# EAGLE design Atari 7800 (EAGLE 9.6.2)
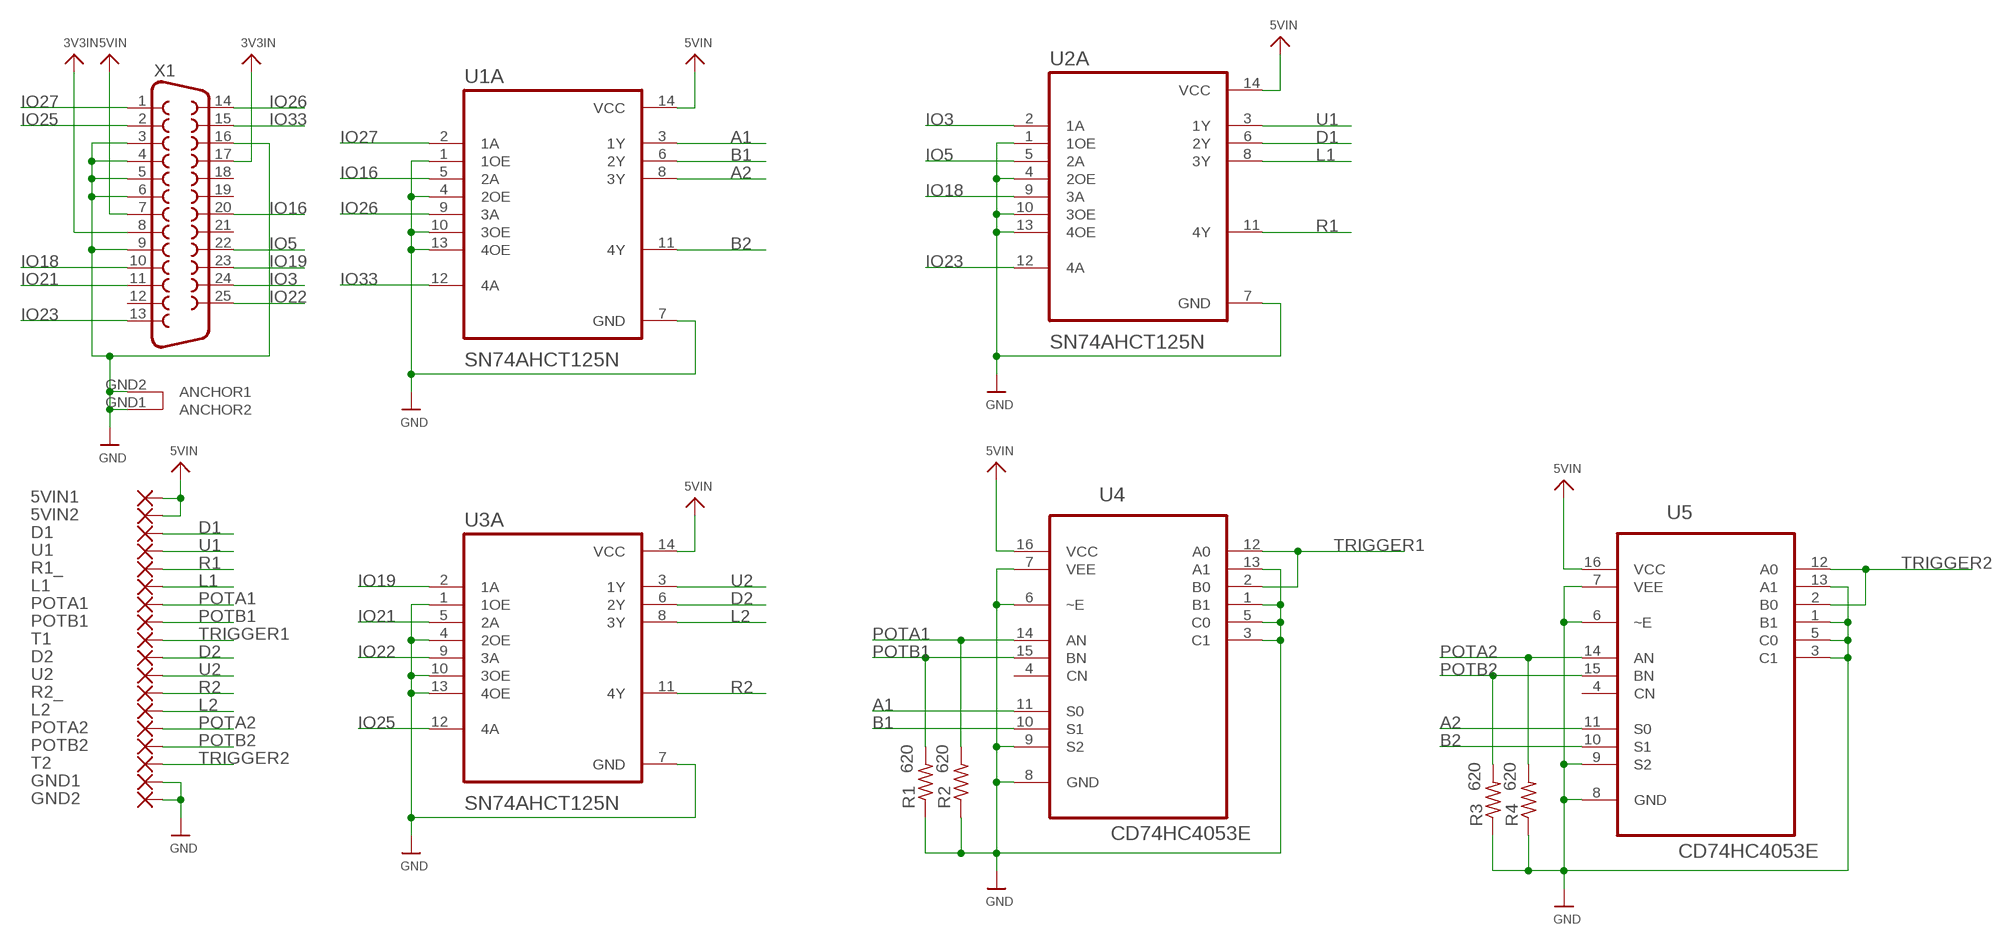
[diagram p0: schematic, sheet 1]

## Parts
5VIN1  SMD5  [SMD2,54-5,08]
5VIN2  SMD5  [SMD2,54-5,08]
D1  SMD5  [SMD2,54-5,08]
D2  SMD5  [SMD2,54-5,08]
GND1  SMD5  [SMD2,54-5,08]
GND2  SMD5  [SMD2,54-5,08]
L1  SMD5  [SMD2,54-5,08]
L2  SMD5  [SMD2,54-5,08]
POTA1  SMD5  [SMD2,54-5,08]
POTA2  SMD5  [SMD2,54-5,08]
POTB1  SMD5  [SMD2,54-5,08]
POTB2  SMD5  [SMD2,54-5,08]
R1  620  R-US_R1206  [R1206]
R1_  SMD5  [SMD2,54-5,08]
R2  620  R-US_R1206  [R1206]
R2_  SMD5  [SMD2,54-5,08]
R3  620  R-US_R1206  [R1206]
R4  620  R-US_R1206  [R1206]
T1  SMD5  [SMD2,54-5,08]
T2  SMD5  [SMD2,54-5,08]
U1  SMD5  [SMD2,54-5,08]
U1A  SN74AHCT125N  [DIP794W45P254L1969H508Q14]
U2  SMD5  [SMD2,54-5,08]
U2A  SN74AHCT125N  [DIP794W45P254L1969H508Q14]
U3A  SN74AHCT125N  [DIP794W45P254L1969H508Q14]
U4  CD74HC4053E  [DIP254P762X508-16]
U5  CD74HC4053E  [DIP254P762X508-16]
X1  DB25_FEMALEHP  [F25HP]

## Nets
3V3IN: X1.8 X1.17
5VIN: 5VIN1.1(P) 5VIN2.1(P) U1A.14(VCC) U2A.14(VCC) U3A.14(VCC) U4.16(VCC) U5.16(VCC) X1.7
A1: U1A.3(1Y) U4.11(S0)
A2: U1A.8(3Y) U5.11(S0)
B1: U1A.6(2Y) U4.10(S1)
B2: U1A.11(4Y) U5.10(S1)
D1: D1.1(P) U2A.6(2Y)
D2: D2.1(P) U3A.6(2Y)
GND: GND1.1(P) GND2.1(P) R1.1 R2.1 R3.1 R4.1 U1A.1(1OE) U1A.4(2OE) U1A.7(GND) U1A.10(3OE) U1A.13(4OE) U2A.1(1OE) U2A.4(2OE) U2A.7(GND) U2A.10(3OE) U2A.13(4OE) U3A.1(1OE) U3A.4(2OE) U3A.7(GND) U3A.10(3OE) U3A.13(4OE) U4.1(B1) U4.3(C1) U4.5(C0) U4.6(~E) U4.7(VEE) U4.8(GND) U4.9(S2) U4.13(A1) U5.1(B1) U5.3(C1) U5.5(C0) U5.6(~E) U5.7(VEE) U5.8(GND) U5.9(S2) U5.13(A1) X1.3 X1.4 X1.5 X1.6 X1.9 X1.16 X1.GND1(ANCHOR2) X1.GND2(ANCHOR1)
IO3: U2A.2(1A) X1.24
IO5: U2A.5(2A) X1.22
IO16: U1A.5(2A) X1.20
IO18: U2A.9(3A) X1.10
IO19: U3A.2(1A) X1.23
IO21: U3A.5(2A) X1.11
IO22: U3A.9(3A) X1.25
IO23: U2A.12(4A) X1.13
IO25: U3A.12(4A) X1.2
IO26: U1A.9(3A) X1.14
IO27: U1A.2(1A) X1.1
IO33: U1A.12(4A) X1.15
L1: L1.1(P) U2A.8(3Y)
L2: L2.1(P) U3A.8(3Y)
POTA1: POTA1.1(P) R2.2 U4.14(AN)
POTA2: POTA2.1(P) R4.2 U5.14(AN)
POTB1: POTB1.1(P) R1.2 U4.15(BN)
POTB2: POTB2.1(P) R3.2 U5.15(BN)
R1: R1_.1(P) U2A.11(4Y)
R2: R2_.1(P) U3A.11(4Y)
TRIGGER1: T1.1(P) U4.2(B0) U4.12(A0)
TRIGGER2: T2.1(P) U5.2(B0) U5.12(A0)
U1: U1.1(P) U2A.3(1Y)
U2: U2.1(P) U3A.3(1Y)
Unconnected: U4.4(CN) U5.4(CN) X1.12 X1.18 X1.19 X1.21

## Library data of the parts
5VIN1 5VIN2 D1 D2 GND1 GND2 L1 L2 POTA1 POTA2 POTB1 POTB2 R1_ R2_ T1 T2 U1 U2 = wirepad:SMD5: SMD PAD
R1-R4 = adafruit:R-US_: RESISTOR, American symbol
U1A U2A U3A = SN74AHCT125N:SN74AHCT125N: None Check prices <https://pricing.snapeda.com/parts/SN74AHCT125N/Texas%20Instruments/view-part?ref=eda>; AVAILABILITY: In Stock; DESCRIPTION: Quadruple Bus Buffer Gates With 3-State Outputs 14-PDIP -40 to 125; MF: Texas Instruments; MP: SN74AHCT125N; PACKAGE: PDIP-14 Texas Instruments; PRICE: None; PURCHASE-URL: https://pricing.snapeda.com/search/part/SN74AHCT125N/?ref=eda
U4 U5 = CD74HC4053E:CD74HC4053E: HIGH-SPEED CMOS LOGIC ANALOG MULTIPLEXERS/DEMULTIPLEXERS; DESCRIPTION: 5-V, 2:1 (SPDT) 3-channel analog switch; DIGI-KEY_PART_NUMBER: 296-9219-5-ND; MF: Texas; MP: CD74HC4053E; PACKAGE: PDIP-16 Texas Instruments; PURCHASE-URL: https://pricing.snapeda.com/search/part/CD74HC4053E/?ref=eda
X1 = SparkFun-Retired:DB25_FEMALE: 25 Pin male connector. PCB edge mount for regular PCB thicknesses. This connector will connect directly to the back of a PC parallel port or through a normal DB25 extension cable (M/F). SKU: PRT-08287

## Board
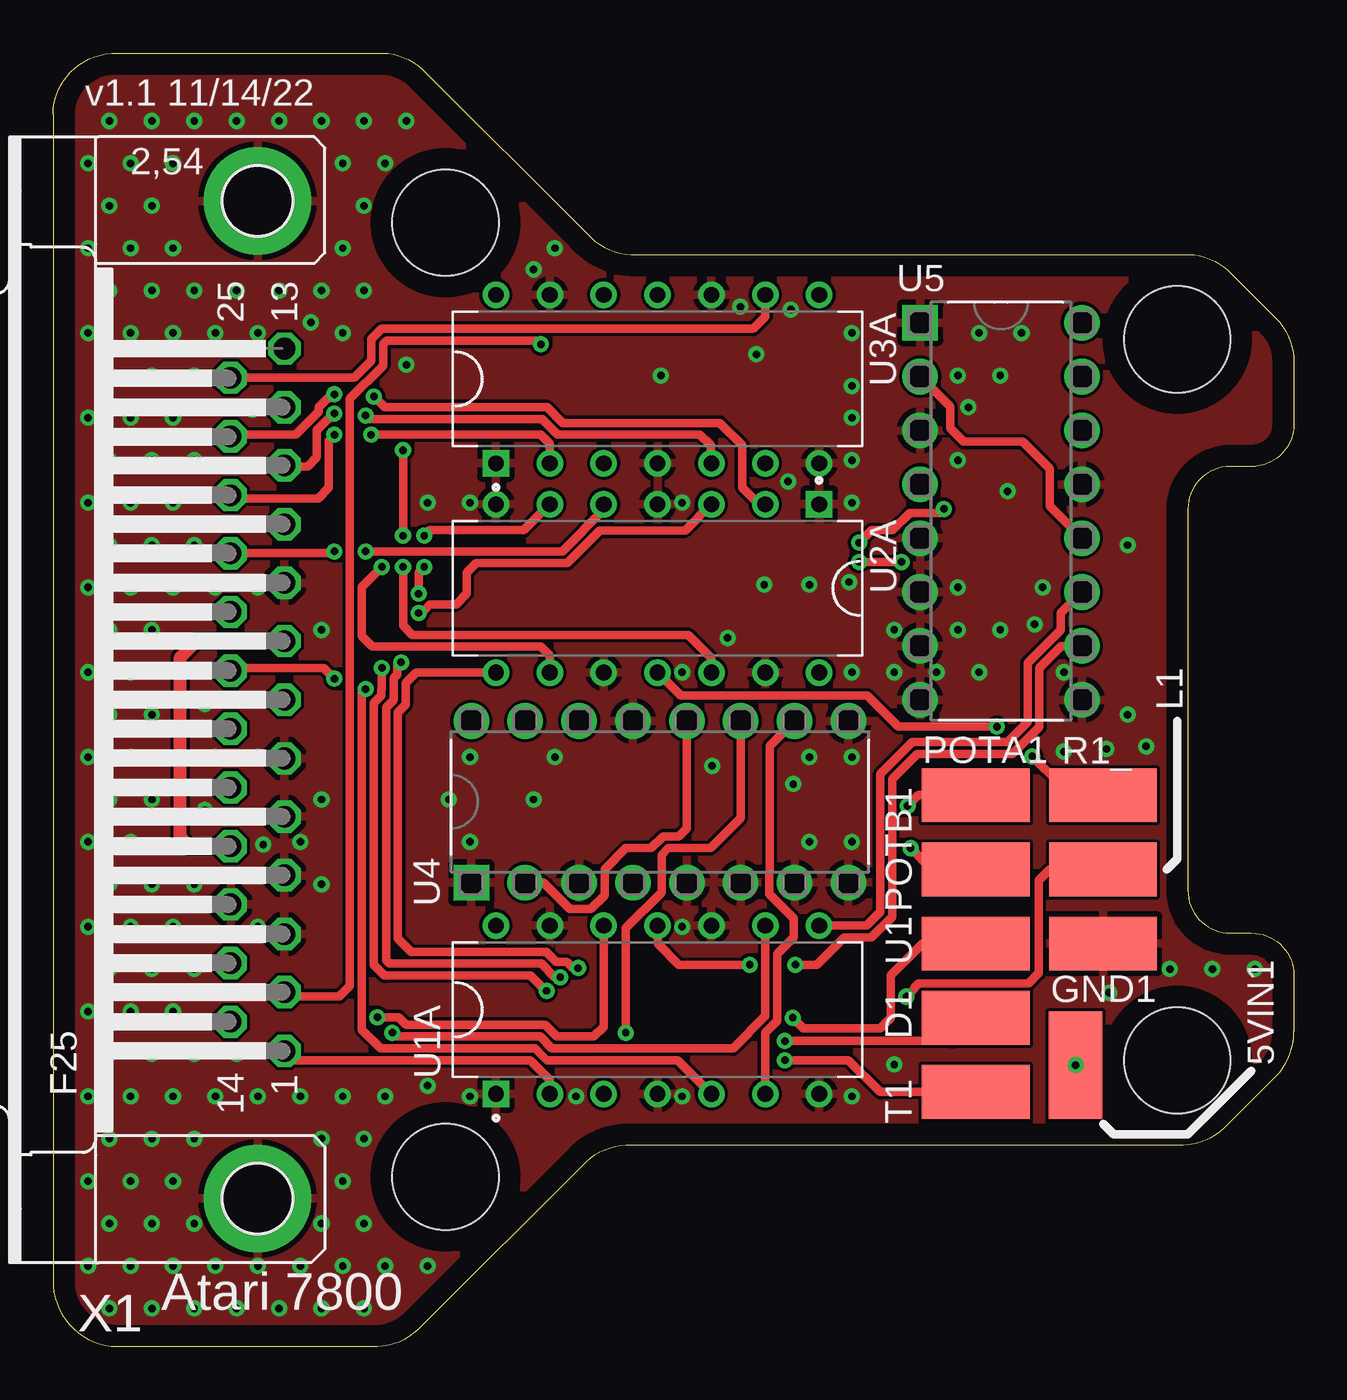
[diagram p1: board, top side]
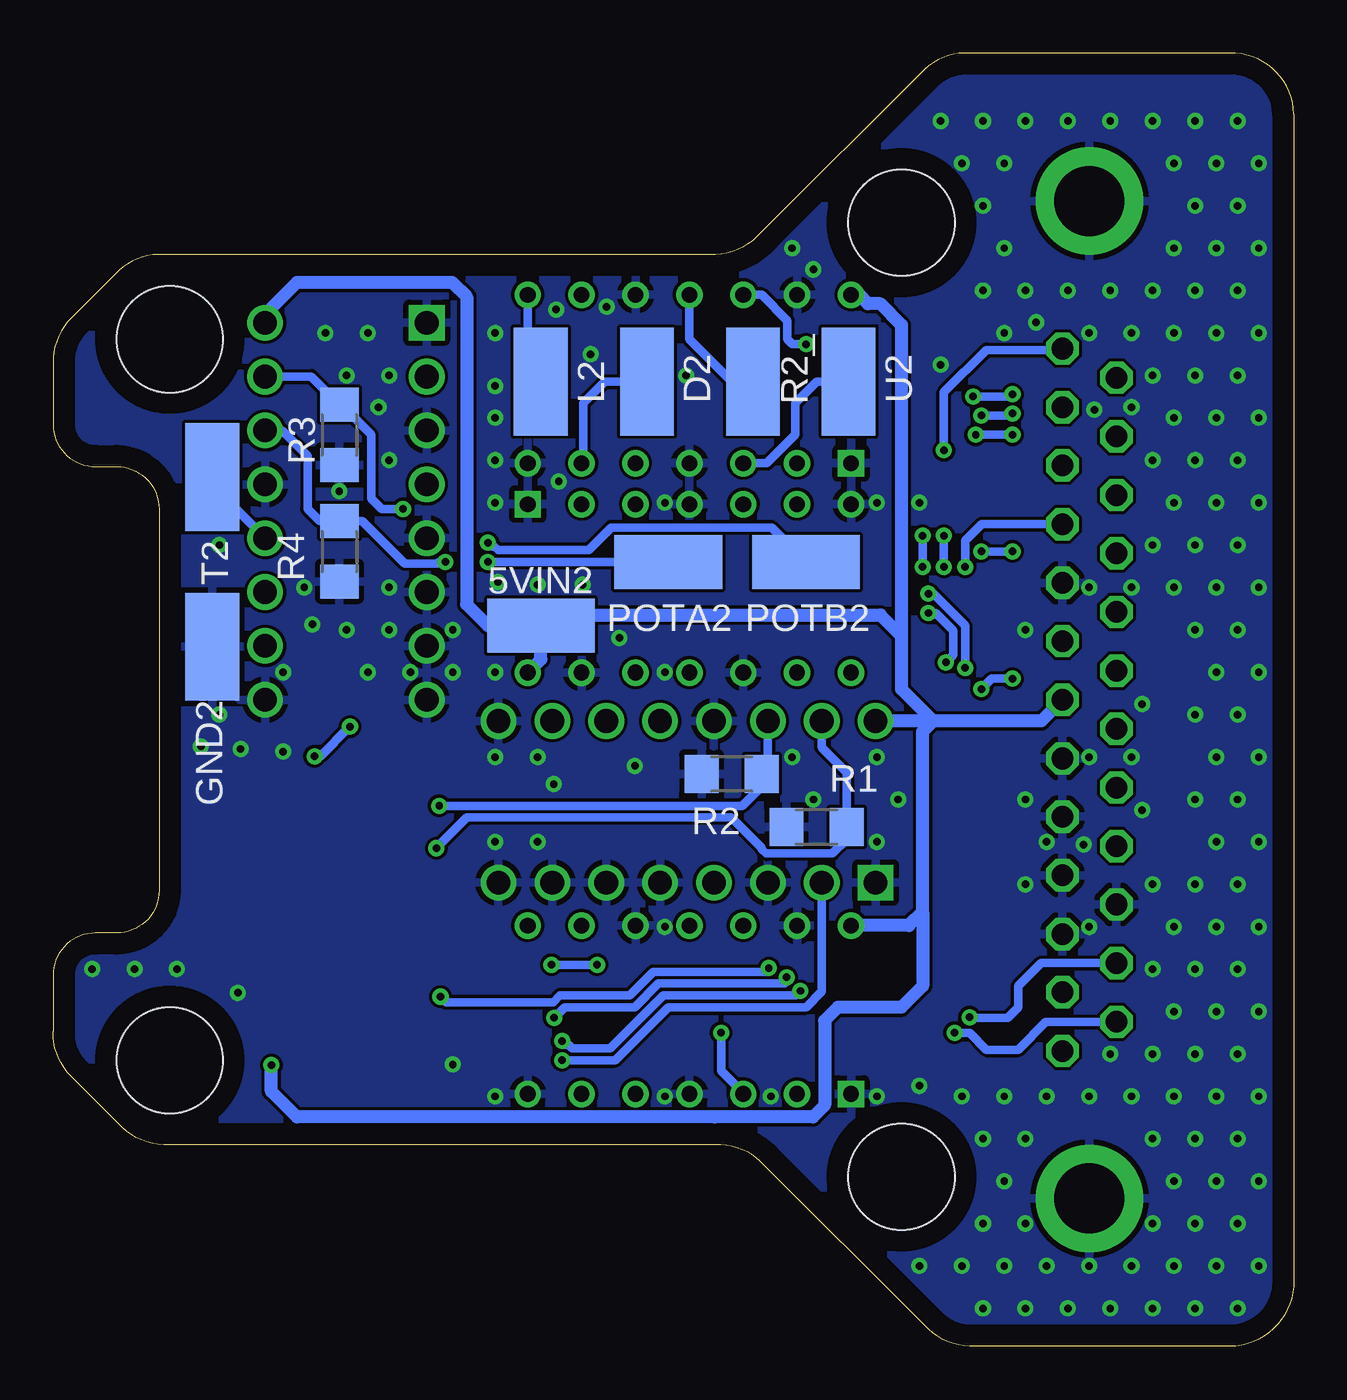
[diagram p2: board, bottom side, seen from below]

Size 58.5 x 61 mm. Coordinates in mm from the lower left corner, seen from the top.
Outline: 0,58.12 0,3.12 arc90 3.03,0 15.29,0 arc45 17.41,1 25.15,8.74 arc-45 27.27,9.5 53.29,9.5 arc45 55.41,10.5 57.65,12.74 arc45 58.5,14.86 58.5,17.5 arc90 56.5,19.5 55.5,19.5 arc-90 53.5,21.5 53.5,39.5 arc-90 55.5,41.5 56.5,41.5 arc90 58.5,43.5 58.5,46.38 arc45 57.65,48.5 55.41,50.74 arc45 53.29,51.5 27.27,51.5 arc-45 25.15,52.5 17.41,60.24 arc45 15.29,61 3.03,61 arc90 0,58.12
Copper layers (1*16): Top 0.035mm / dielectric 1.5mm / Bottom 0.035mm
Design rules "default": minimum track width 6mil, minimum drill 0.35mm, track to track 6mil, track to pad 6mil, pad to pad 6mil, via to via 6mil, smd to smd 6mil, copper to edge 40mil, drill to drill 6mil, minimum pad ring 10mil, minimum via ring 8mil, stop-mask expansion 4mil, vias tented up to drill 0.5mm, thermal gap 10mil
Holes 5 mm at 53,13.5 53,47.5 18.5,53 18.5,8

### Footprints (pad centres in the part's own frame; a part is rotated, then mirrored left to right if it is on the bottom)
SMD2,54-5,08 = smd 2.54 x 5.08: 1 0,0
R1206 = smd 1.6 x 1.803: 1 -1.422,0; 2 1.422,0
DIP794W45P254L1969H508Q14 = drill 0.74 pad 1.14 square: 1 -3.97,7.62 | drill 0.74 pad 1.14: 2 -3.97,5.08; 3 -3.97,2.54; 4 -3.97,0; 5 -3.97,-2.54; 6 -3.97,-5.08; 7 -3.97,-7.62; 8 3.97,-7.62; 9 3.97,-5.08; 10 3.97,-2.54; 11 3.97,0; 12 3.97,2.54; 13 3.97,5.08; 14 3.97,7.62
DIP254P762X508-16 = drill 1.118 square: 1 -7.62,17.78 | drill 1.118: 2 -7.62,15.24; 3 -7.62,12.7; 4 -7.62,10.16; 5 -7.62,7.62; 6 -7.62,5.08; 7 -7.62,2.54; 8 -7.62,0; 9 0,0; 10 0,2.54; 11 0,5.08; 12 0,7.62; 13 0,10.16; 14 0,12.7; 15 0,15.24; 16 0,17.78
F25HP = drill 1.016 octagon: 1 -16.561,-1.27; 2 -13.792,-1.27; 3 -11.049,-1.27; 4 -8.28,-1.27; 5 -5.512,-1.27; 6 -2.769,-1.27; 7 0,-1.27; 8 2.769,-1.27; 9 5.512,-1.27; 10 8.28,-1.27; 11 11.049,-1.27; 12 13.792,-1.27; 13 16.561,-1.27; 14 -15.189,1.27; 15 -12.421,1.27; 16 -9.652,1.27; 17 -6.909,1.27; 18 -4.14,1.27; 19 -1.372,1.27; 20 1.372,1.27; 21 4.14,1.27; 22 6.909,1.27; 23 9.652,1.27; 24 12.421,1.27; 25 15.189,1.27 | drill 3.302 pad 5.08: GND1 -23.52,0; GND2 23.52,0

### Placement (x,y rotation side)
5VIN1  48.21,13.28 0 top
5VIN2  35.5,34 270 bottom
D1  43.5,15.5 270 top
D2  30.5,45.5 180 bottom
GND1  49.5,19 90 top
GND2  51,33 180 bottom
L1  49.5,22.5 270 top
L2  35.5,45.5 180 bottom
POTA1  43.5,26 270 top
POTA2  29.5,37 270 bottom
POTB1  43.5,22.5 270 top
POTB2  23,37 270 bottom
R1  22.5,24.5 0 bottom
R1_  49.5,26 270 top
R2  26.5,27 0 bottom
R2_  25.5,45.5 180 bottom
R3  45,43 90 bottom
R4  45,37.5 90 bottom
T1  43.5,12 270 top
T2  51,41 0 bottom
U1  43.5,19 270 top
U1A  28.5,15.88 90 top
U2  21,45.5 180 bottom
U2A  28.5,35.75 270 top
U3A  28.5,45.63 90 top
U4  37.5,29.5 90 top
U5  48.5,30.5 0 top
X1  9.64,30.5 90 top

### Tracks (layer width: path | path; a pad name or v marks a point on that pad's centre or on a via)
3V3IN
  Top 0.61: X1.17 6.41,23.59 6,24 6,32.5 6.77,33.27 X1.8
5VIN  (via drill 0.35)
  Bottom 0.61: 17.5,20.5 18.15,19.85 U1A.14 | U3A.14 20.5,49.6 20.08,49.18 19.5,49.18 18.5,48.18 18.5,33.5 | U5.16 48.5,48.68 47,50.18 39.68,50.18 39,49.5 39,35 38,34 5VIN2.1 | 5VIN2.1 35,34 34.5,34.5 19.5,34.5 18.5,33.5 | U2A.14 35.5,32.4 5VIN2.1 | 17.5,20.5 17.5,17 18.5,16 21.5,16 22.13,15.37 22.13,11.37 22.67,10.83 27.3,10.83 27.3,10.82 47,10.82 48.21,12.03 5VIN1.1 | 18.5,33.5 18.5,31 17,29.5 | X1.7 11.91,29.5 17,29.5 | 17,29.5 U4.16 | 17,29.5 17.5,29 17.5,20.5
  other vias: 48.21,13.28
A1  (via drill 0.35)
  Top 0.406: v27,14.79 27,19.74 28.69,21.42 28.69,23.19 29,23.5 31,23.5 32.42,24.92 U4.11
  Bottom 0.406: U1A.3 25.96,11.96 27,13 v27,14.79
A2
  Top 0.406: U1A.8 38.35,19.85 39,20.5 39,27 40.5,28.5 45,28.5 45.94,29.44 45.94,32.23 47.5,33.79 47.5,34.58 U5.11
B1
  Top 0.406: U1A.6 33.58,14.79 34.14,15.35 34.14,18.52 34.92,19.3 34.92,20.19 33.77,21.35 33.77,22.37 33.78,22.39 33.78,28.32 U4.10
B2  (via drill 0.35)
  Top 0.406: U1A.11 28.5,19 29.5,18 v32.85,18 | v35,18 36,18 37.29,19.29 38.58,19.29 39.56,20.27 39.56,26.77 40.73,27.94 45.23,27.94 46.5,29.21 46.5,32 47.54,33.04 U5.10
  Bottom 0.406: v32.85,18 v35,18
D1  (via drill 0.35)
  Top 0.406: D1.1 42.41,14.41 v34.5,14.41 | v23.27,16.77 23.23,16.77 22.5,17.5 15.62,17.5 15.12,18 15.12,30.35 15.47,30.7 15.47,30.97 15.5,31 v15.5,32 | v17.23,35.5 17.23,36.5 v17.5,36.77 | v17.5,38.23 17.77,38.5 22.2,38.5 U2A.6
  Bottom 0.406: v34.5,14.41 34.33,14.23 34.2,14.23 34.02,14.06 32.23,14.06 29.73,16.56 23.48,16.56 v23.27,16.77 | v15.5,32 15.5,34 17,35.5 v17.23,35.5 | v17.5,36.77 v17.5,38.23
D2
  Bottom 0.406: U3A.6 33.5,41.74 33.5,44.5 32.5,45.5 D2.1
GND  (via drill 0.35)
  other vias: 2.66,1.8 1.66,3.8 2.66,5.8 1.66,7.8 2.66,9.8 1.66,11.8 2.66,13.8 1.66,15.8 2.66,17.8 1.66,19.8 2.66,21.8 1.66,23.8 2.66,25.8 1.66,27.8 2.66,29.8 1.66,31.8 2.66,33.8 1.66,35.8 2.66,37.8 1.66,39.8 2.66,41.8 1.66,43.8 2.66,45.8 1.66,47.8 2.66,49.8 1.66,51.8 2.66,53.8 1.66,55.8 2.66,57.8 4.66,1.8 3.66,3.8 4.66,5.8 3.66,7.8 4.66,9.8 3.66,11.8 4.66,13.8 3.66,15.8 4.66,17.8 3.66,19.8 4.66,21.8 3.66,23.8 4.66,25.8 3.66,27.8 4.66,29.8 3.66,31.8 4.66,33.8 3.66,35.8 4.66,37.8 3.66,39.8 4.66,41.8 3.66,43.8 4.66,45.8 3.66,47.8 4.66,49.8 3.66,51.8 4.66,53.8 3.66,55.8 4.66,57.8 6.66,1.8 5.66,3.8 6.66,5.8 5.66,7.8 6.66,9.8 5.66,11.8 6.66,13.8 5.66,15.8 6.66,17.8 5.66,19.8 6.66,21.8 7.16,25.3 7.16,30.3 5.66,35.8 6.66,37.8 5.66,39.8 6.66,41.8 5.66,43.8 6.66,45.8 5.66,47.8 6.66,49.8 5.66,51.8 5.66,55.8 6.66,57.8 8.66,1.8 7.66,3.8 7.66,11.8 8.66,13.8 7.66,27.8 7.66,35.8 7.66,44.3 7.66,47.8 8.66,49.8 8.66,57.8 10.66,1.8 9.66,3.8 9.66,11.8 9.66,19.8 9.91,23.67 9.66,27.8 9.66,35.8 9.4,44.18 9.66,47.8 10.66,49.8 10.66,57.8 12.66,1.8 11.66,3.8 12.66,5.8 12.66,9.8 11.66,11.8 12.66,21.8 11.66,23.8 12.66,25.8 12.66,33.8 12.16,48.3 12.66,49.8 12.66,57.8 14.66,1.8 13.66,3.8 14.66,5.8 13.66,7.8 14.66,9.8 13.66,11.8 13.66,47.8 14.66,49.8 13.66,51.8 14.66,53.8 13.66,55.8 14.66,57.8 15.66,3.8 15.66,11.8 16.66,46.3 15.66,55.8 16.66,57.8 17.66,3.8 17.66,12.3 18.66,25.8 17.66,39.8 19.66,11.8 24.66,11.8 19.66,23.8 19.66,27.8 19.66,39.8 22.66,25.8 23.66,27.8 22.66,50.8 23.66,51.8 34.9,26.53 31.07,27.38 28.66,45.8 29.66,11.8 29.66,19.8 29.66,31.8 31.8,33.42 29.66,39.8 32.4,49.03 33.53,35.92 34.66,40.8 33.16,46.8 34.78,48.91 35.66,23.8 35.66,27.8 35.66,35.92 37.66,11.8 39.66,13.3 37.66,23.8 37.66,27.8 37.66,31.8 42.66,35.8 37.53,36.05 37.66,39.8 37.66,43.8 37.66,47.8 39.66,31.8 39.66,33.8 46.66,35.8 37.66,41.8 46.28,34.05 41.66,31.8 42.66,33.8 42.66,41.8 42.66,45.8 43.66,31.8 44.66,33.8 37.66,45.3 43.16,44.3 44.66,45.8 43.66,47.8 45.01,40.34 45.66,47.8 47.66,28.05 47.66,31.8 49.78,16.69 49.66,28.18 50.66,29.8 50.66,37.8 52.66,17.8 51.53,28.3 54.66,17.8 56.66,17.8
  pour Bottom: 0,0 0,61.12 28.53,61.12 28.53,51.62 59.03,51.62 59.03,9.5 28.03,9.5 28.03,0
  pour Top: 0,0 0,61.12 28.53,61.12 28.53,51.62 59.03,51.62 59.03,9.5 28.03,9.5 28.03,0
IO3  (via drill 0.35)
  Top 0.406: U2A.2 33.28,39.72 32.5,40.5 32.5,42.5 31.44,43.56 24.02,43.56 23.29,44.29 15.63,44.29 v15.13,44.8 | X1.24 8.45,43 11.44,43 12.53,44.09 12.53,44.3 12.96,44.73 13.09,44.73 v13.27,44.91
  Bottom 0.406: v15.13,44.8 13.38,44.8 v13.27,44.91
IO5  (via drill 0.35)
  Top 0.406: U2A.5 25.96,39.46 24,37.5 v14.73,37.5 | v13.27,37.5 13.18,37.41 X1.22
  Bottom 0.406: v14.73,37.5 v13.27,37.5
IO16  (via drill 0.35)
  Top 0.406: U1A.5 29.45,13.5 23.29,13.5 23.14,13.64 22.73,14.06 15.44,14.06 14.56,14.94 14.56,30.82 v14.73,31 | v13.27,31.5 12.77,32 8.5,32 X1.20
  Bottom 0.406: v14.73,31 14.23,31.5 v13.27,31.5
IO18  (via drill 0.35)
  Top 0.406: U2A.9 23.42,32.58 23,33 15.06,33 14.56,33.5 14.56,35.83 v15.5,36.77
  Bottom 0.406: v15.5,36.77 15.5,38 14.72,38.78 X1.10
IO19  (via drill 0.35)
  Top 0.406: U3A.2 23.42,42.58 23,43 v15,43 | v13.27,43 13,42.73 13,40.5 12.5,40 8.52,40 X1.23
  Bottom 0.406: v15,43 v13.27,43
IO21  (via drill 0.35)
  Top 0.406: U3A.5 31,41.7 31,42.5 30.5,43 23.79,43 23.06,43.73 14.91,43.73 v14.73,43.91 | v13.27,44 13,43.73 12.96,43.73 12.44,43.21 12.44,41.94 12,41.5 10.96,41.5 X1.11
  Bottom 0.406: v14.73,43.91 13.36,43.91 v13.27,44
IO22
  Top 0.406: U3A.9 33.58,48.58 33,48 15.5,48 15,47.5 15,46.5 14.19,45.69 X1.25
IO23  (via drill 0.35)
  Top 0.406: U2A.12 31.04,32.46 29.94,33.56 16.94,33.56 16.5,34 v16.5,36.77 | v16.5,38.23 v16.5,42.27
  Bottom 0.406: v16.5,36.77 v16.5,38.23 | v16.5,42.27 16.5,45 14.5,47 10.5,47 10.56,47.06 X1.13
IO25  (via drill 0.35)
  Top 0.406: X1.2 11.12,16.5 13.5,16.5 14,17 14,44.71 15.56,46.27 15.56,47.27 15.73,47.44 22.82,47.44 v23,47.27
  Bottom 0.406: v23,47.27 23.64,47.27 23.87,47.5 23.87,48.37 25.1,49.6 U3A.12
IO26  (via drill 0.35)
  Top 0.406: U1A.9 33.58,15.58 32.06,14.06 23.52,14.06 22.96,14.62 16.18,14.62 v16,14.79
  Bottom 0.406: v16,14.79 15.29,14.79 14.5,14 13,14 11.69,15.31 X1.14
IO27
  Top 0.406: U1A.2 23.42,12.58 22.5,13.5 11.35,13.5 X1.1
IO33  (via drill 0.35)
  Top 0.406: U1A.12 25.96,15.08 25.5,14.62 23.75,14.62 23.19,15.18 16.65,15.18 16.3,15.53 v15.29,15.53
  Bottom 0.406: v15.29,15.53 15.27,15.5 13.5,15.5 13,16 13,17 11.92,18.08 X1.15
L1  (via drill 0.35)
  Top 0.406: U2A.8 17.11,31.78 16.62,31.29 16.62,30.27 16.26,29.91 16.26,19.24 16.88,18.62 23.25,18.62 23.72,18.14 24.21,18.14 24.51,17.85 v24.76,17.85 | v40.23,16.5 40.6,16.87 40.6,16.92 40.81,17.13 46,17.13 46.48,17.61 46.48,21.98 47,22.5 L1.1
  Bottom 0.406: v24.76,17.85 24.93,17.68 30.19,17.68 31.31,16.56 34.6,16.56 34.93,16.23 39.97,16.23 v40.23,16.5
L2
  Bottom 0.406: U3A.8 36.12,46.12 L2.1
POTA1  (via drill 0.35)
  Top 0.406: v40.29,25.5 40.79,26 POTA1.1
  Bottom 0.406: U4.14 24.8,27.28 R2.2 25.08,26.42 26,25.5 v40.29,25.5
POTA2  (via drill 0.35)
  Top 0.406: v38,37 v40,37
  Bottom 0.406: U5.14 47.7,43.2 46.5,42 46.5,39.5 45.92,38.92 R4.2 43.92,38.92 41.93,36.93 40.39,36.93 40.31,37 v40,37 | POTA2.1 v38,37
POTB1  (via drill 0.35)
  Top 0.406: v40.43,23.5 41.43,22.5 POTB1.1
  Bottom 0.406: U4.15 22.26,28.26 21.08,27.08 R1.2 21.08,23.92 21.76,23.24 24.87,23.24 25.08,23.45 25.08,23.5 26.52,24.94 38.99,24.94 v40.43,23.5
POTB2  (via drill 0.35)
  Top 0.406: v38,37.91 38.59,38.5 39.57,38.5 40.39,39.31 41.81,39.31 v42,39.5
  Bottom 0.406: U5.15 46.32,45.74 R3.2 44.92,44.42 43.5,43 43.5,40 43,39.5 v42,39.5 | POTB2.1 24.63,38.63 32.19,38.63 33.25,37.56 37.52,37.56 37.7,37.73 37.83,37.73 v38,37.91
R1  (via drill 0.35)
  Top 0.406: U2A.11 29.59,30.69 38.39,30.69 39.85,29.23 v44.5,29.23 | v46.16,27.84 47.5,26.5 47.5,26 R1_.1
  Bottom 0.406: v44.5,29.23 45.9,27.84 v46.16,27.84
R2
  Bottom 0.406: U3A.11 28.5,47.5 26.5,45.5 R2_.1
TRIGGER1  (via drill 0.35)
  Top 0.406: T1.1 39,12 37.5,13.5 v34.5,13.5 | U4.12 29.88,24.44 29.5,24.06 28.77,24.06 28.21,23.5 27,23.5 26,22.5 26,21.28 25.36,20.64 24.35,20.64 23.11,21.88 U4.2
  Bottom 0.406: U4.2 22.26,16.74 23,16 29.5,16 32,13.5 v34.5,13.5
TRIGGER2
  Top 0.406: U5.2 42.29,44.33 42.29,43.31 42.93,42.67 45.72,42.67 46.99,41.4 46.99,39.63 U5.12
  Bottom 0.406: U5.12 51,40.62 T2.1
U1  (via drill 0.35)
  Top 0.406: U1.1 41,19 39.5,17.5 39.5,15.5 39,15 35.37,15 v34.87,15.5 | v23.91,17.41 23.66,17.41 23.02,18.06 15.85,18.06 15.7,18.2 15.7,30.14 16.06,30.5 16.06,31.52 16.23,31.7 16.23,32.09 v16.41,32.27 | v17.23,34.59 17.41,34.77 17.54,34.77 17.77,35 19,35 19.5,35.5 19.5,36.5 19.94,36.94 24.23,36.94 25.77,38.48 29.8,38.48 U2A.3
  Bottom 0.406: v34.87,15.5 34.37,16 31.08,16 29.96,17.12 24,17.12 23.91,17.21 v23.91,17.41 | v16.41,32.27 16.06,32.62 16.06,33.77 16.88,34.59 v17.23,34.59
U2
  Bottom 0.406: U3A.3 24.84,41.66 23.5,43 23.5,44.5 22.5,45.5 U2.1

### Text on the board
tPlace: v1.1 11/14/22 | Atari 7800